# Altium schematic sheet Peripherals.SchDoc
size A3; SheetNumber: 4; SheetTotal: 5
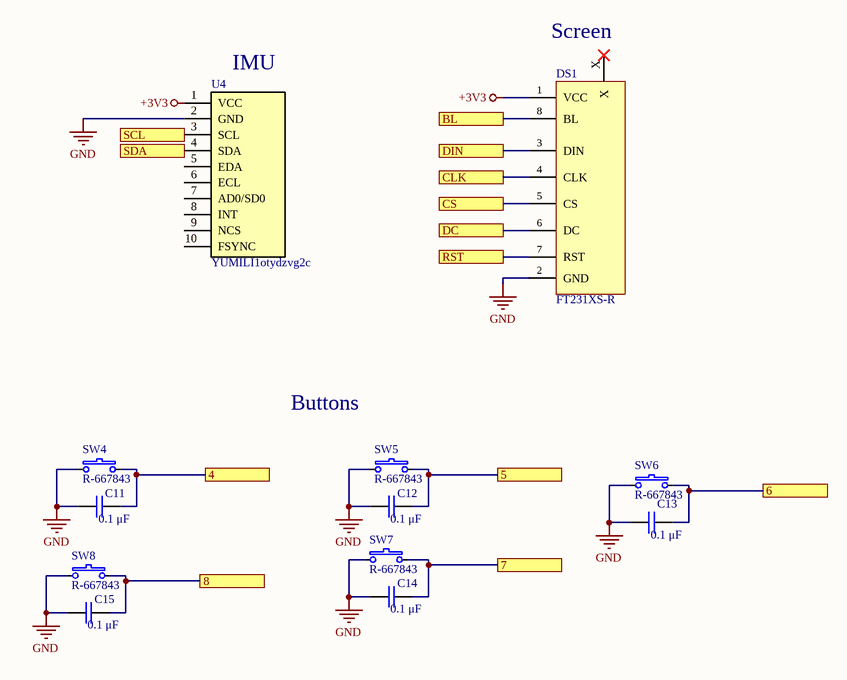
[diagram p0: Peripherals.SchDoc]

## Parts
C11  0.1 μF  [Capacitor 0603]
C12  0.1 μF  [Capacitor 0603]
C13  0.1 μF  [Capacitor 0603]
C14  0.1 μF  [Capacitor 0603]
C15  0.1 μF  [Capacitor 0603]
DS1  FT231XS-R  [Screen]
SW4  R-667843  [R-667843]
SW5  R-667843  [R-667843]
SW6  R-667843  [R-667843]
SW7  R-667843  [R-667843]
SW8  R-667843  [R-667843]
U4  YUMILI1otydzvg2c  [GY-9250]

## Ports
4 (see Main[5B], MCU[5B]), 5 (see Main[5B], MCU[5B]), 6 (see Main[5B], MCU[5B]), 7 (see Main[5B], MCU[5B]), 8 (see Main[5B], MCU[5B]), BL (see Main[5A], MCU[5B]), CLK (see Main[5B], MCU[5B]), CS (see Main[5B], MCU[5B]), DC (see Main[5B], MCU[5B]), DIN (see Main[5A], MCU[5B]), RST (see Main[5B], MCU[5B]), SCL (see Main[5A], MCU[5B]), SDA (see Main[5A], MCU[5B])

## Nets
+3V3: DS1.1(VCC) U4.1(VCC)
GND: C11.A C12.A C13.A C14.A C15.A DS1.2(GND) SW4.A SW5.A SW6.A SW7.A SW8.A U4.2(GND)
4: C11.B SW4.B ; port 4
5: C12.B SW5.B ; port 5
6: C13.B SW6.B ; port 6
7: C14.B SW7.B ; port 7
8: C15.B SW8.B ; port 8
BL: DS1.8(BL) ; port BL
CLK: DS1.4(CLK) ; port CLK
CS: DS1.5(CS) ; port CS
DC: DS1.6(DC) ; port DC
DIN: DS1.3(DIN) ; port DIN
RST: DS1.7(RST) ; port RST
SCL: U4.3(SCL) ; port SCL
SDA: U4.4(SDA) ; port SDA

Not connected (* = marked no-connect by the designer): DS1 X*; U4 5(EDA) 6(ECL) 7(AD0/SD0) 8(INT) 9(NCS) 10(FSYNC)

## Notes on the sheet
- (near DS1) Screen
- (near U4) IMU
- (near SW5) Buttons

## Library data of the parts
C11-C15 = 0.1 μF 0603: Capacitor 0.1 μF; Manufacturer: Samsung Electro-Mechanics; Manufacturer Part Number: CL10B104KB8NNWC; Supplier 1: Digikey; Supplier Part Number 1: 1276-1935-1-ND; Value: 0.1 μF
DS1 = LCD-screen: 240×320, General 2.4inch LCD Display Module, 65K RGB; Manufacturer: FTDI, Future Technology Devices International Ltd; Supplier 1: Waveshare; Supplier Part Number 1: 768-1129-1-ND; Manufacturer Part Number: FT231XS-R
SW4-SW8 = R-667843: SWITCH TACTILE SPST-NO 0.05A 12V; Manufacturer: Mitsumi Electric Company Ltd; Supplier 1: Digikey; Supplier Part Number 1: 2508-R-667843CT-ND; Manufacturer Part Number: R-667843
U4 = GY-9250: YUMILI Gyroskopmodul MPU-9250 GY-9250 9-axel 16-bitars; Supplier 1: Amazon; Supplier Part Number 1: B09XZQNQBV; Manufacturer: YUMILI; Manufacturer Part Number: YUMILI1otydzvg2c